# Altium schematic sheet Power.SchDoc
size A4; SheetNumber: 2; SheetTotal: 3
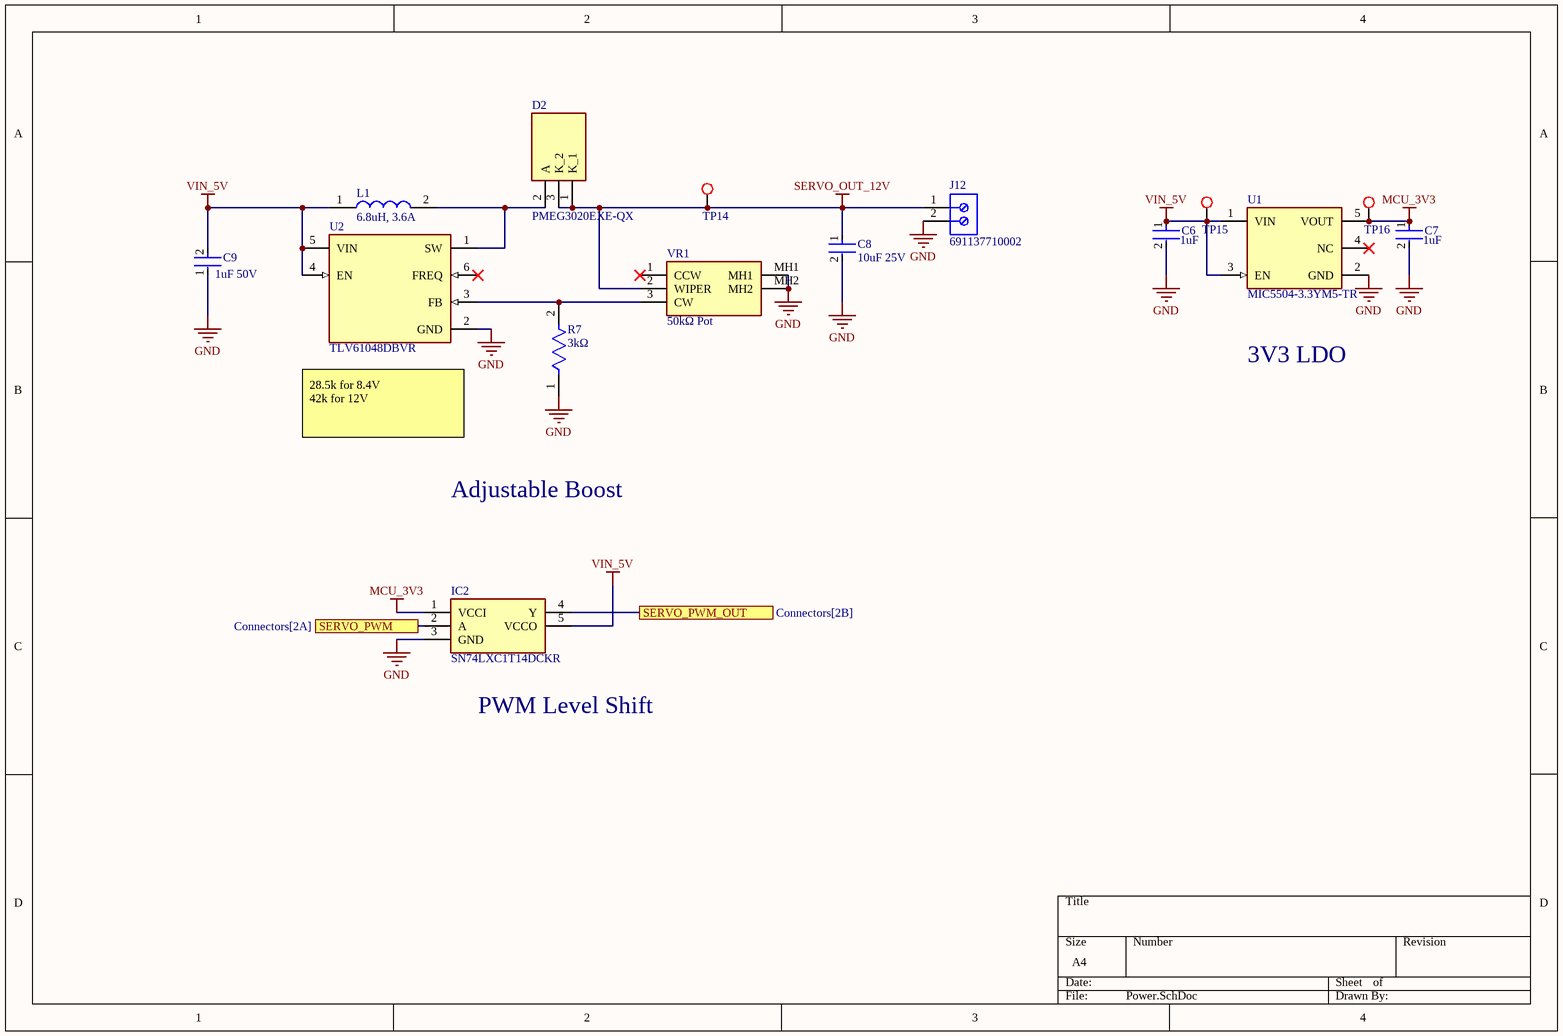
[diagram p0: Power.SchDoc]

## Parts
C6  1uF  [FP-CL10-IPC_C]
C7  1uF  [FP-CL10-IPC_C]
C8  10uF 25V  [FP-CL31-IPC_B]
C9  1uF 50V  [FP-C1608-080-0_1-IPC_B]
D2  PMEG3020EXE-QX  [PMEG4010EXEX]
IC2  SN74LXC1T14DCKR  [SOT65P210X110-5N]
J12  691137710002  [691137710002]
L1  6.8uH, 3.6A  [VLS6045]
R7  3kΩ  [FP-RG2012-IPC_A]
TP14  TP  [Testpoint]  (value not drawn)
TP15  TP  [Testpoint]  (value not drawn)
TP16  TP  [Testpoint]  (value not drawn)
U1  MIC5504-3.3YM5-TR  [FP-SOT23-5LD-PL-1-MFG]
U2  TLV61048DBVR  [FP-DBV0006A-IPC_B]
VR1  50kΩ Pot  [PTV09A4030SA503]

## Ports
SERVO_PWM (see Connectors[2A]), SERVO_PWM_OUT (see Connectors[2B])

## Nets
GND: C6.2 C7.2 C8.2 C9.1 IC2.3(GND) J12.2 R7.1 U1.2(GND) U2.2(GND) VR1.MH1 VR1.MH2
MCU_3V3: C7.1 IC2.1(VCCI) TP16.0 U1.5(VOUT)
SERVO_OUT_12V: C8.1 D2.1(K_1) D2.3(K_2) J12.1 TP14.0 VR1.2(WIPER)
VIN_5V: C6.1 C9.2 IC2.5(VCCO) L1.1 TP15.0 U1.1(VIN) U1.3(EN) U2.4(EN) U2.5(VIN)
SERVO_PWM: IC2.2(A) ; port SERVO_PWM
SERVO_PWM_OUT: IC2.4(Y) ; port SERVO_PWM_OUT
NetD2_2: D2.2(A) L1.2 U2.1(SW)
NetR7_2: R7.2 U2.3(FB) VR1.3(CW)

Not connected (* = marked no-connect by the designer): U1 4(NC)*; U2 6(FREQ)*; VR1 1(CCW)*

## Notes on the sheet
- 3V3 LDO
- (near U2) 28.5k for 8.4V
  42k for 12V
- Adjustable Boost
- PWM Level Shift

## Library data of the parts
C6 C7 = CMP-13271-003399-1: Cap Ceramic 1uF 10V X5R ±10% Pad SMD 0603 +85°C T/R; Min Operating Temperature: -55°C; Max Operating Temperature: 85°C; Dielectric: X5R; Contact Plating: Tin; Height: 0.8mm; Voltage: 10V; Packaging: Tape and Reel; Voltage Rating: 10V; Capacitance: 1uF; Package Quantity: 1; Width: 0.031inch; Length: 1.6mm; Depth: 0.8mm; Case/Package: 0603; Case Code (Imperial): 0603; Thickness: 0.035inch; Radiation Hardening: No; Tolerance: 10%; Case Code (Metric): 1608; Mount: Surface Mount
C8 = CMP-13271-001434-1: Cap Ceramic 10uF 25V X7R ±10% SMD 1206 +125°C Embossed T/R; Max Operating Temperature: 125°C; Dielectric: X7R; Voltage Rating: 25V; Tolerance: 10%; Min Operating Temperature: -55°C; Height: 1.6mm; Mount: Surface Mount; Width: 0.063inch; Thickness: 0.071inch; Case Code (Metric): 3216; Contact Plating: Tin; Packaging: Tape and Reel; Case/Package: 1206; Capacitance: 10uF; Case Code (Imperial): 1206; Length: 0.126inch; Radiation Hardening: No; Package Quantity: 1; Depth: 1.6mm
C9 = CMP-2000-06025-2: Multilayer Ceramic Capacitors 1μF ±10% 50V X5R SMD 0603; Lead Free: Lead Free; Height: 0.8mm; Mount: Surface Mount; Radiation Hardening: No; Thickness: 0.035inch; Length: 1.6mm; Max Operating Temperature: 85°C; REACH SVHC: No SVHC; Min Operating Temperature: -55°C; Construction: Flat; RoHS Compliant: Yes; Voltage Rating: 50V; Dielectric: X5R; Packaging: Tape and Reel; Termination: SMD/SMT; Voltage Rating (DC): 50V; Case Code (Imperial): 0603; Voltage: 50V; Width: 0.031inch; Weight: 7.1E-05oz; Capacitance: 1uF; Depth: 0.8mm; Case Code (Metric): 1608; Series: C; Case/Package: 0603; Tolerance: 10%; Resistor Type: Ceramic; Number of Pins: 2; Dielectric Material: Ceramic; Package Quantity: 1
D2 = PMEG3020EXE-QX: Schottky Diode; Manufacturer_Name: Nexperia; Datasheet Link: https://assets.nexperia.com/documents/data-sheet/PMEG4010EXE.pdf; Height: 1mm; Manufacturer_Part_Number: PMEG3020EXE-QX; Mouser Part Number: 771-PMEG3020EXE-Q; Mouser Price/Stock: https://www.mouser.co.uk/ProductDetail/Nexperia/PMEG3020EXE-QX?qs=dbcCsuKDzFVlrH7wpIOIMQ%3D%3D
IC2 = SN74LXC1T14DCKR: Integrated Circuit; Manufacturer_Name: Texas Instruments; Datasheet Link: https://www.ti.com/lit/gpn/sn74lxc1t14; Height: 1.1mm; Manufacturer_Part_Number: SN74LXC1T14DCKR; Mouser Part Number: 595-SN74LXC1T14DCKR; Mouser Price/Stock: https://www.mouser.co.uk/ProductDetail/Texas-Instruments/SN74LXC1T14DCKR?qs=tlsG%2FOw5FFhO0IEgLqYGiw%3D%3D; Arrow Part Number: SN74LXC1T14DCKR; Arrow Price/Stock: https://www.arrow.com/en/products/sn74lxc1t14dckr/texas-instruments?region=nac
J12 = CMP-1502-03324-2: NexarPartId: 78871135; Voltage Rating: 300V; Number of Contacts: 2; Current Rating: 16A; Lead Pitch: 5mm; Height: 11.6mm; Packaging: Box; RoHS: Non-Compliant; Contact Material: Nickel, Tin; Max Operating Temperature: 120°C; Number of Pins: 2; Min Operating Temperature: -30°C; Number of Rows: 1
L1 = VLS6045EX-6R8M: Inductor; Manufacturer_Name: TDK; Datasheet Link: https://product.tdk.com/system/files/dam/doc/product/inductor/inductor/smd/catalog/inductor_commercial_power_vls6045ex_en.pdf; Manufacturer_Part_Number: VLS6045EX-6R8M; Mouser Part Number: 810-VLS6045EX-6R8M; Mouser Price/Stock: https://www.mouser.co.uk/ProductDetail/TDK/VLS6045EX-6R8M?qs=LtAzLad%252BoeXmJR68%2FnJvXA%3D%3D; Arrow Part Number: VLS6045EX-6R8M; Arrow Price/Stock: https://www.arrow.com/en/products/vls6045ex-6r8m/tdk?utm_currency=USD&region=nac
R7 = CMP-2001-02900-2: Automotive Metal Thin Film Chip Resistor, 0805, 3kΩ, 0.1%, 25ppm/°C, 0.125W, 150V; Resistance: 3kR; Max Power Dissipation: 125mW; Voltage Rating: 100V; Power Rating: 100mW; Width: 1.25mm; Case/Package: 0805; Resistor Type: Thin Film; Case Code (Metric): 2012; Min Operating Temperature: -55°C; Series: RG; Length: 0.079inch; Temperature Coefficient: 25ppm/°C; Height: 0.02inch; Number of Terminations: 2; RoHS Compliant: Yes; Termination: SMD/SMT; Packaging: Tape and Reel; Max Operating Temperature: 155°C; Package Quantity: 1; Size Code: 0805; Case Code (Imperial): 0805; Lead Free: Lead Free; Voltage Rating (DC): 150V; Tolerance: 0.1%; Features: Automotive AEC-Q200
TP14-TP16 = Testpoint
U1 = CMP-2000-07604-2: IC REG LINEAR 3.3V 300MA SOT23-5; Quiescent Current: 38uA; Operating Supply Current: 42uA; Max Input Voltage: 5.5V; Min Input Voltage: 2.5V; Output Type: Fixed; Power Supply Rejection Ratio (PSRR): 60dB; Dropout Voltage: 380mV; Accuracy: 3%; Number of Outputs: 1; Nominal Output Voltage: 3.3V; Max Output Current: 300mA; Length: 2.9mm; Mount: Surface Mount; Width: 1.6mm; Packaging: Tape and Reel; Output Current: 300mA; Min Operating Temperature: -40°C; Max Operating Temperature: 125°C; Height: 1.1mm; Case/Package: SOT-23-5; REACH SVHC: No SVHC; Number of Pins: 5; Output Voltage: 3.3V
U2 = CMP-04918-000262-1: IC REG BOOST ADJ SOT23-6
VR1 = PTV09A-4030S-A503: Variable Resistor; Manufacturer_Name: Bourns; Datasheet Link: https://www.bourns.com/docs/Product-Datasheets/PTV09.pdf; Height: 30.5mm; Manufacturer_Part_Number: PTV09A-4030S-A503; Mouser Part Number: 652-PTV09A-4030SA503; Mouser Price/Stock: https://www.mouser.co.uk/ProductDetail/Bourns/PTV09A-4030S-A503?qs=pxDZlBjcsCjgtyjThPtRRg%3D%3D